# EAGLE schematic arca-2.0 (EAGLE 9.6.2)

## Sheet 1 of 8: Power
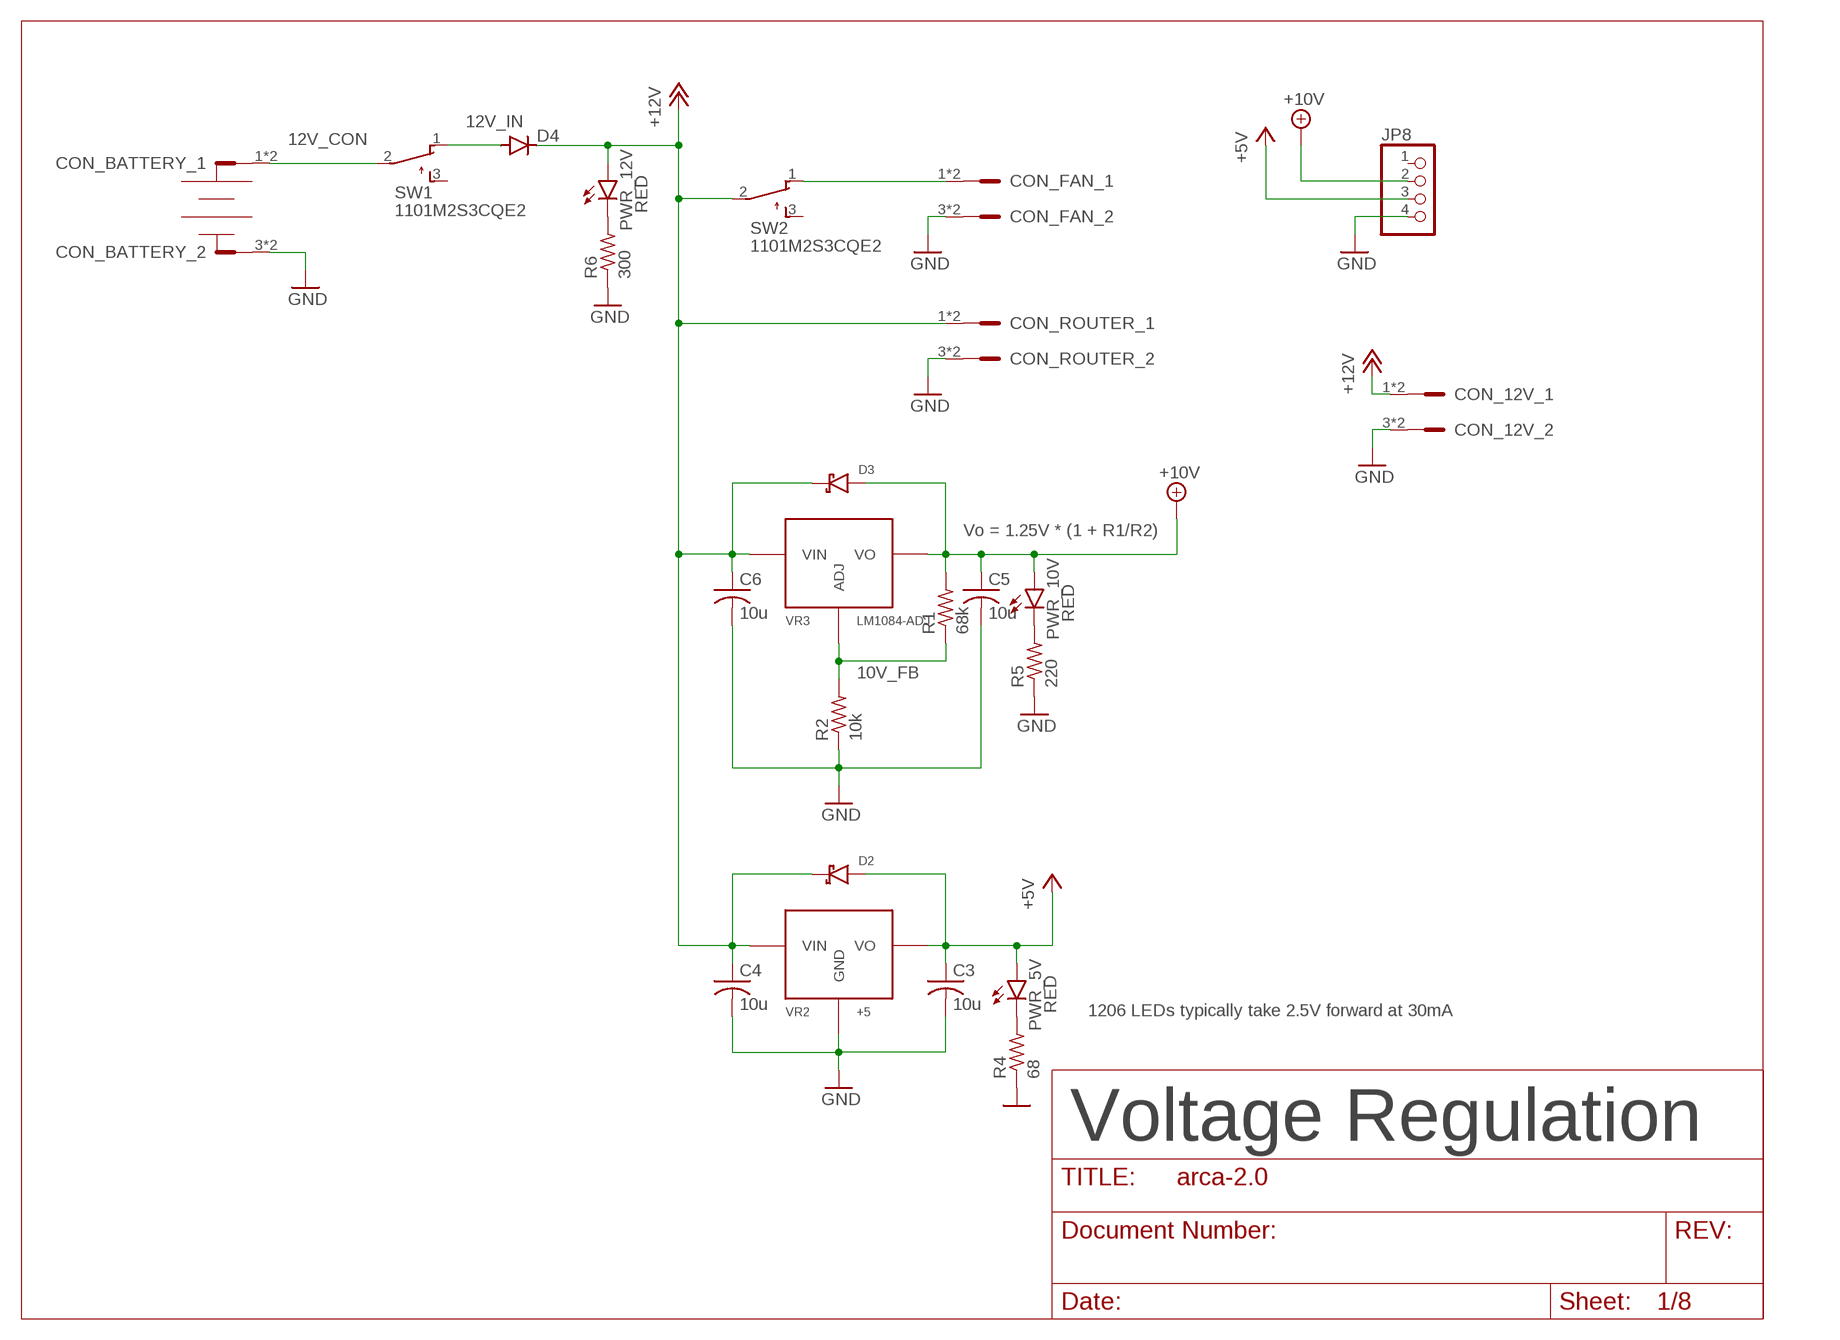
[diagram p0: schematic, sheet 1]

### Parts
C3  10u  C-USC1206  [C1206]
C4  10u  C-USC1206  [C1206]
C5  10u  C-USC1206  [C1206]
C6  10u  C-USC1206  [C1206]
CON_12V  LPTA-2POS  [8.2X2]
CON_BATTERY  LPTA-2POS  [8.2X2]
CON_FAN  LPTA-2POS  [8.2X2]
CON_ROUTER  LPTA-2POS  [8.2X2]
D2  SS54  [SS*]
D3  SS54  [SS*]
D4  DIODE-DO201-15  [DO201-15]
JP8  PINHD-1X4  [1X04]
PWR_5V  RED  LEDCHIPLED_1206  [CHIPLED_1206]
PWR_10V  RED  LEDCHIPLED_1206  [CHIPLED_1206]
PWR_12V  RED  LEDCHIPLED_1206  [CHIPLED_1206]
R1  68k  R-US_R1206  [R1206]
R2  10k  R-US_R1206  [R1206]
R4  68  R-US_R1206  [R1206]
R5  220  R-US_R1206  [R1206]
R6  300  R-US_R1206  [R1206]
SW1  1101M2S3CQE2  [1101M2S3CQE2]
SW2  1101M2S3CQE2  [1101M2S3CQE2]
VR2  +5  LM1084  [TO-263-3L]
VR3  LM1084-ADJ  [TO-263-3L]

### Nets
10V_FB: R1.1 R2.2 VR3.P$1(ADJ)
12V_CON [12V]: CON_BATTERY.1 CON_BATTERY.2 SW1.2(P)
12V_IN [12V]: D4.A SW1.1(O)
+5V [5V]: C3.1 D2.P$2 JP8.3 PWR_5V.A VR2.P$2(VO) VR2.P$4(VO) VR2.P$5(VO) ; also sheet 2,3,6,7,8
+10V [10V]: C5.1 D3.P$2 JP8.2 PWR_10V.A R1.2 VR3.P$2(VO) VR3.P$4(VO) VR3.P$5(VO) ; also sheet 4,5
+12V [12V]: C4.1 C6.1 CON_12V.1 CON_12V.2 CON_ROUTER.1 CON_ROUTER.2 D2.P$1 D3.P$1 D4.C PWR_12V.A SW2.2(P) VR2.P$3(VIN) VR3.P$3(VIN) ; also sheet 2
GND: C3.2 C4.2 C5.2 C6.2 CON_12V.3 CON_12V.4 CON_BATTERY.3 CON_BATTERY.4 CON_FAN.3 CON_FAN.4 CON_ROUTER.3 CON_ROUTER.4 JP8.4 R2.1 R4.1 R5.1 R6.1 VR2.P$1(GND) ; also sheet 2,3,4,5,6,7,8
N$3: PWR_5V.C R4.2
N$4: PWR_10V.C R5.2
N$5: PWR_12V.C R6.2
N$48: CON_FAN.1 CON_FAN.2 SW2.1(O)
Unconnected: JP8.1 SW1.3(S) SW2.3(S)

### Notes on the sheet
- Vo = 1.25V * (1 + R1/R2)
- 1206 LEDs typically take 2.5V forward at 30mA
- Voltage Regulation

## Sheet 2 of 8: Drivers
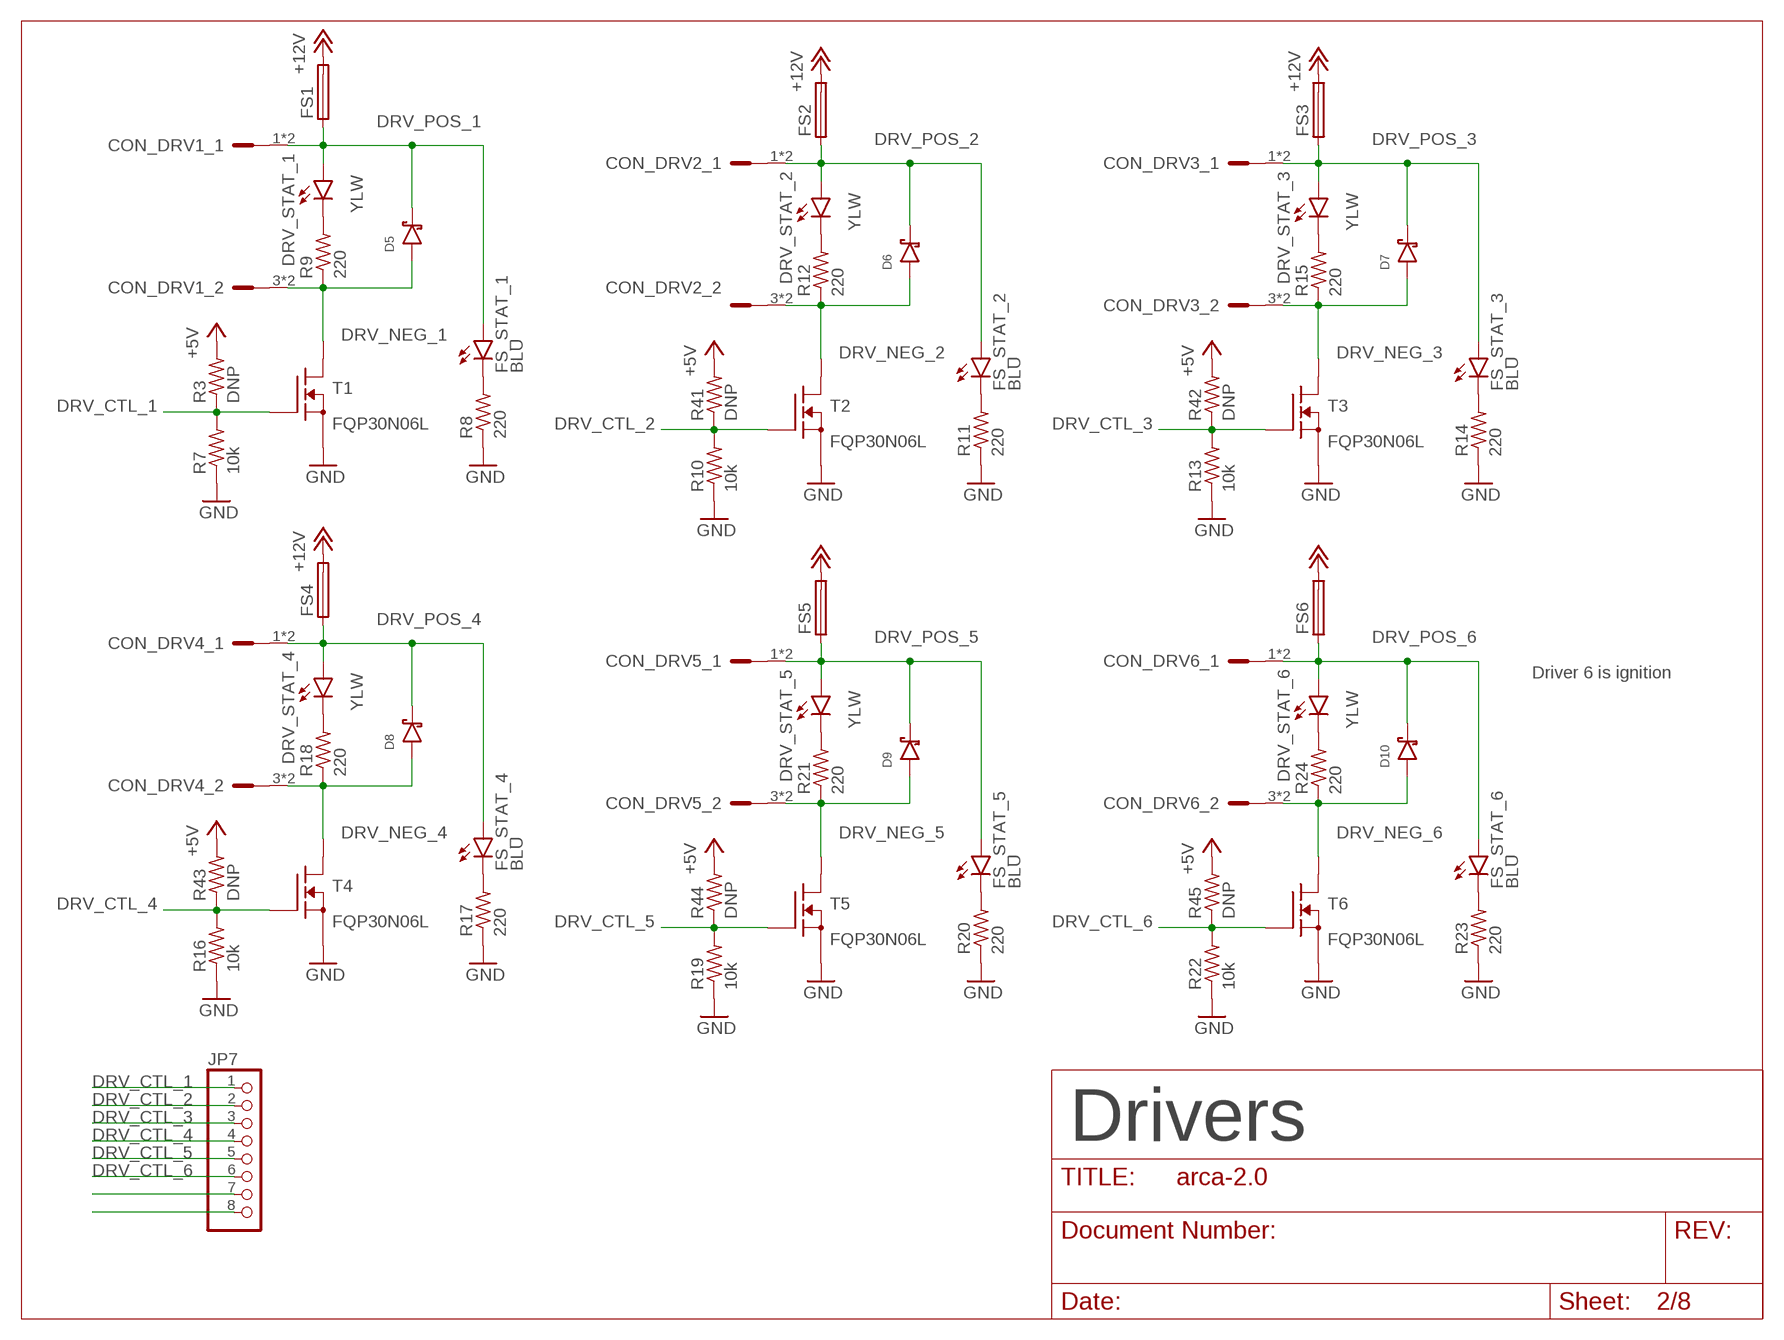
[diagram p1: schematic, sheet 2]

### Parts
CON_DRV1  LPTA-2POS  [8.2X2]
CON_DRV2  LPTA-2POS  [8.2X2]
CON_DRV3  LPTA-2POS  [8.2X2]
CON_DRV4  LPTA-2POS  [8.2X2]
CON_DRV5  LPTA-2POS  [8.2X2]
CON_DRV6  LPTA-2POS  [8.2X2]
D5  SS54  [SS*]
D6  SS54  [SS*]
D7  SS54  [SS*]
D8  SS54  [SS*]
D9  SS54  [SS*]
D10  SS54  [SS*]
DRV_STAT_1  YLW  LEDCHIPLED_1206  [CHIPLED_1206]
DRV_STAT_2  YLW  LEDCHIPLED_1206  [CHIPLED_1206]
DRV_STAT_3  YLW  LEDCHIPLED_1206  [CHIPLED_1206]
DRV_STAT_4  YLW  LEDCHIPLED_1206  [CHIPLED_1206]
DRV_STAT_5  YLW  LEDCHIPLED_1206  [CHIPLED_1206]
DRV_STAT_6  YLW  LEDCHIPLED_1206  [CHIPLED_1206]
FS1  HOLDER_3588-20  [3588-20]
FS2  HOLDER_3588-20  [3588-20]
FS3  HOLDER_3588-20  [3588-20]
FS4  HOLDER_3588-20  [3588-20]
FS5  HOLDER_3588-20  [3588-20]
FS6  HOLDER_3588-20  [3588-20]
FS_STAT_1  BLU  LEDCHIPLED_1206  [CHIPLED_1206]
FS_STAT_2  BLU  LEDCHIPLED_1206  [CHIPLED_1206]
FS_STAT_3  BLU  LEDCHIPLED_1206  [CHIPLED_1206]
FS_STAT_4  BLU  LEDCHIPLED_1206  [CHIPLED_1206]
FS_STAT_5  BLU  LEDCHIPLED_1206  [CHIPLED_1206]
FS_STAT_6  BLU  LEDCHIPLED_1206  [CHIPLED_1206]
JP7  PINHD-1X8  [1X08]
R3  DNP  R-US_R1206  [R1206]
R7  10k  R-US_R1206  [R1206]
R8  220  R-US_R1206  [R1206]
R9  220  R-US_R1206  [R1206]
R10  10k  R-US_R1206  [R1206]
R11  220  R-US_R1206  [R1206]
R12  220  R-US_R1206  [R1206]
R13  10k  R-US_R1206  [R1206]
R14  220  R-US_R1206  [R1206]
R15  220  R-US_R1206  [R1206]
R16  10k  R-US_R1206  [R1206]
R17  220  R-US_R1206  [R1206]
R18  220  R-US_R1206  [R1206]
R19  10k  R-US_R1206  [R1206]
R20  220  R-US_R1206  [R1206]
R21  220  R-US_R1206  [R1206]
R22  10k  R-US_R1206  [R1206]
R23  220  R-US_R1206  [R1206]
R24  220  R-US_R1206  [R1206]
R41  DNP  R-US_R1206  [R1206]
R42  DNP  R-US_R1206  [R1206]
R43  DNP  R-US_R1206  [R1206]
R44  DNP  R-US_R1206  [R1206]
R45  DNP  R-US_R1206  [R1206]
T1  FQP30N06L  [TO220V]
T2  FQP30N06L  [TO220V]
T3  FQP30N06L  [TO220V]
T4  FQP30N06L  [TO220V]
T5  FQP30N06L  [TO220V]
T6  FQP30N06L  [TO220V]

### Nets
+5V [5V]: R3.2 R41.2 R42.2 R43.2 R44.2 R45.2 ; also sheet 1,3,6,7,8
+12V [12V]: FS1.P$3 FS1.P$4 FS2.P$3 FS2.P$4 FS3.P$3 FS3.P$4 FS4.P$3 FS4.P$4 FS5.P$3 FS5.P$4 FS6.P$3 FS6.P$4 ; also sheet 1
DRV_CTL_1: JP7.1 R3.1 R7.2 T1.1(G) ; also sheet 8
DRV_CTL_2: JP7.2 R10.2 R41.1 T2.1(G) ; also sheet 8
DRV_CTL_3: JP7.3 R13.2 R42.1 T3.1(G) ; also sheet 8
DRV_CTL_4: JP7.4 R16.2 R43.1 T4.1(G) ; also sheet 8
DRV_CTL_5: JP7.5 R19.2 R44.1 T5.1(G) ; also sheet 8
DRV_CTL_6: JP7.6 R22.2 R45.1 T6.1(G) ; also sheet 8
DRV_NEG_1 [Driver]: CON_DRV1.3 CON_DRV1.4 D5.P$2 R9.1 T1.2(D)
DRV_NEG_2 [Driver]: CON_DRV2.3 CON_DRV2.4 D6.P$2 R12.1 T2.2(D)
DRV_NEG_3 [Driver]: CON_DRV3.3 CON_DRV3.4 D7.P$2 R15.1 T3.2(D)
DRV_NEG_4 [Driver]: CON_DRV4.3 CON_DRV4.4 D8.P$2 R18.1 T4.2(D)
DRV_NEG_5 [Driver]: CON_DRV5.3 CON_DRV5.4 D9.P$2 R21.1 T5.2(D)
DRV_NEG_6 [Driver]: CON_DRV6.3 CON_DRV6.4 D10.P$2 R24.1 T6.2(D)
DRV_POS_1 [Driver]: CON_DRV1.1 CON_DRV1.2 D5.P$1 DRV_STAT_1.A FS1.P$1 FS1.P$2 FS_STAT_1.A
DRV_POS_2 [Driver]: CON_DRV2.1 CON_DRV2.2 D6.P$1 DRV_STAT_2.A FS2.P$1 FS2.P$2 FS_STAT_2.A
DRV_POS_3 [Driver]: CON_DRV3.1 CON_DRV3.2 D7.P$1 DRV_STAT_3.A FS3.P$1 FS3.P$2 FS_STAT_3.A
DRV_POS_4 [Driver]: CON_DRV4.1 CON_DRV4.2 D8.P$1 DRV_STAT_4.A FS4.P$1 FS4.P$2 FS_STAT_4.A
DRV_POS_5 [Driver]: CON_DRV5.1 CON_DRV5.2 D9.P$1 DRV_STAT_5.A FS5.P$1 FS5.P$2 FS_STAT_5.A
DRV_POS_6 [Driver]: CON_DRV6.1 CON_DRV6.2 D10.P$1 DRV_STAT_6.A FS6.P$1 FS6.P$2 FS_STAT_6.A
GND: R7.1 R8.1 R10.1 R11.1 R13.1 R14.1 R16.1 R17.1 R19.1 R20.1 R22.1 R23.1 T1.3(S) T2.3(S) T3.3(S) T4.3(S) T5.3(S) T6.3(S) ; also sheet 1,3,4,5,6,7,8
N$1: FS_STAT_2.C R11.2
N$6: DRV_STAT_2.C R12.2
N$7: FS_STAT_3.C R14.2
N$8: FS_STAT_1.C R8.2
N$9: DRV_STAT_1.C R9.2
N$10: DRV_STAT_3.C R15.2
N$11: FS_STAT_4.C R17.2
N$12: DRV_STAT_4.C R18.2
N$13: FS_STAT_5.C R20.2
N$14: DRV_STAT_5.C R21.2
N$15: FS_STAT_6.C R23.2
N$16: DRV_STAT_6.C R24.2
N$67: JP7.7
N$68: JP7.8

### Notes on the sheet
- Driver 6 is ignition
- Drivers

## Sheet 3 of 8: Load Cell Inamps
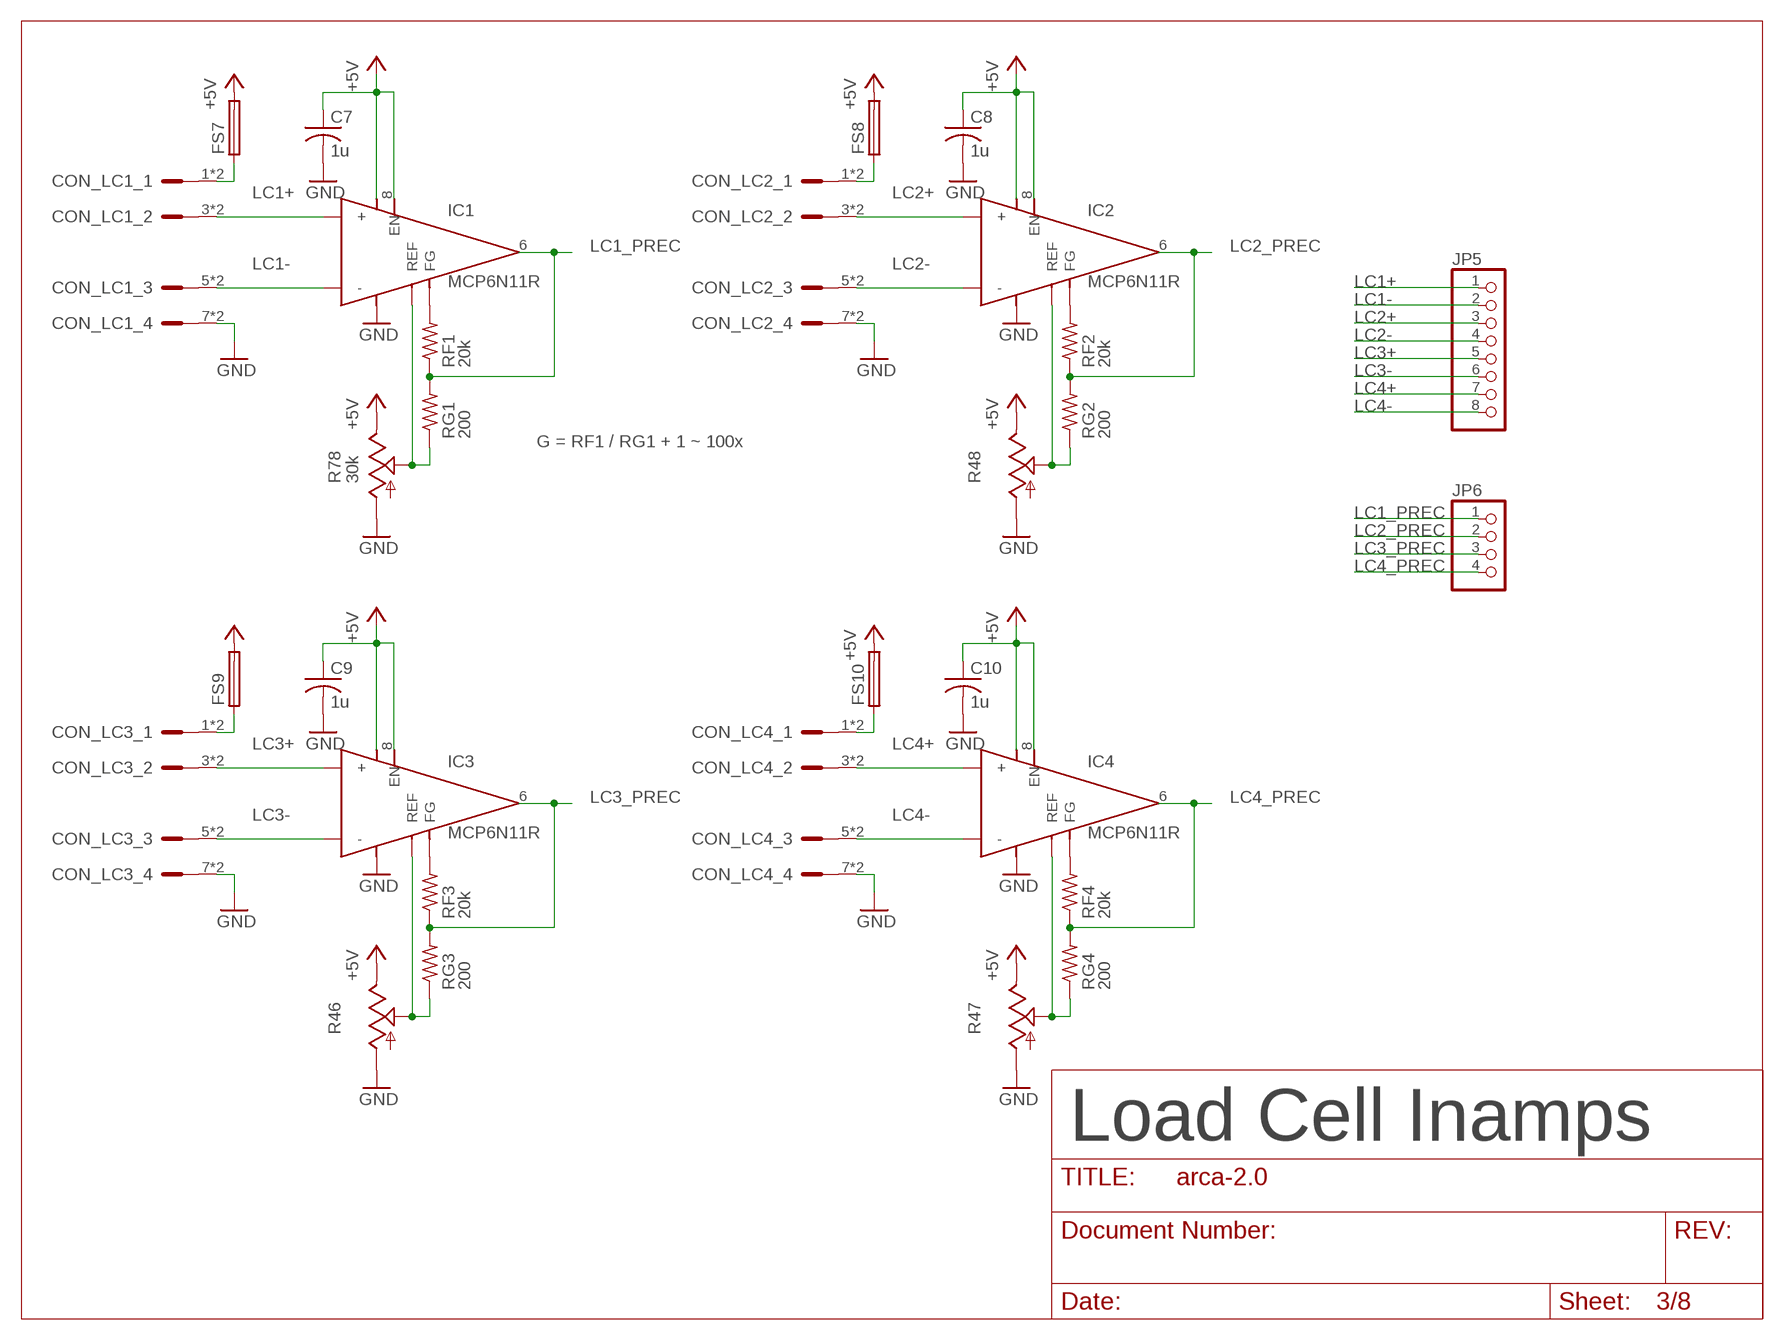
[diagram p2: schematic, sheet 3]

### Parts
C7  1u  C-USC1206  [C1206]
C8  1u  C-USC1206  [C1206]
C9  1u  C-USC1206  [C1206]
C10  1u  C-USC1206  [C1206]
CON_LC1  LPTA-4POS  [8.2X4]
CON_LC2  LPTA-4POS  [8.2X4]
CON_LC3  LPTA-4POS  [8.2X4]
CON_LC4  LPTA-4POS  [8.2X4]
FS7  HOLDER_3588-20  [3588-20]
FS8  HOLDER_3588-20  [3588-20]
FS9  HOLDER_3588-20  [3588-20]
FS10  HOLDER_3588-20  [3588-20]
IC1  MCP6N11R  [SO-8]
IC2  MCP6N11R  [SO-8]
IC3  MCP6N11R  [SO-8]
IC4  MCP6N11R  [SO-8]
JP5  PINHD-1X8  [1X08]
JP6  PINHD-1X4  [1X04]
R46  TRIM_US-S64W  [S64W]
R47  TRIM_US-S64W  [S64W]
R48  TRIM_US-S64W  [S64W]
R78  30k  TRIM_US-S64W  [S64W]
RF1  20k  R-US_R1206  [R1206]
RF2  20k  R-US_R1206  [R1206]
RF3  20k  R-US_R1206  [R1206]
RF4  20k  R-US_R1206  [R1206]
RG1  200  R-US_R1206  [R1206]
RG2  200  R-US_R1206  [R1206]
RG3  200  R-US_R1206  [R1206]
RG4  200  R-US_R1206  [R1206]

### Nets
+5V [5V]: C7.1 C8.1 C9.1 C10.1 FS7.P$3 FS7.P$4 FS8.P$3 FS8.P$4 FS9.P$3 FS9.P$4 FS10.P$3 FS10.P$4 IC1.7(+V) IC1.8(EN) IC2.7(+V) IC2.8(EN) IC3.7(+V) IC3.8(EN) IC4.7(+V) IC4.8(EN) R46.E R47.E R48.E R78.E ; also sheet 1,2,6,7,8
GND: C7.2 C8.2 C9.2 C10.2 CON_LC1.7 CON_LC1.8 CON_LC2.7 CON_LC2.8 CON_LC3.7 CON_LC3.8 CON_LC4.7 CON_LC4.8 IC1.4(-V) IC2.4(-V) IC3.4(-V) IC4.4(-V) R46.A R47.A R48.A R78.A ; also sheet 1,2,4,5,6,7,8
LC1+: CON_LC1.3 CON_LC1.4 IC1.3(+) JP5.1
LC1-: CON_LC1.5 CON_LC1.6 IC1.2(-) JP5.2
LC1_PREC: IC1.6(OUT) JP6.1 RF1.1 RG1.2 ; also sheet 4
LC2+: CON_LC2.3 CON_LC2.4 IC2.3(+) JP5.3
LC2-: CON_LC2.5 CON_LC2.6 IC2.2(-) JP5.4
LC2_PREC: IC2.6(OUT) JP6.2 RF2.1 RG2.2 ; also sheet 4
LC3+: CON_LC3.3 CON_LC3.4 IC3.3(+) JP5.5
LC3-: CON_LC3.5 CON_LC3.6 IC3.2(-) JP5.6
LC3_PREC: IC3.6(OUT) JP6.3 RF3.1 RG3.2 ; also sheet 4
LC4+: CON_LC4.3 CON_LC4.4 IC4.3(+) JP5.7
LC4-: CON_LC4.5 CON_LC4.6 IC4.2(-) JP5.8
LC4_PREC: IC4.6(OUT) JP6.4 RF4.1 RG4.2 ; also sheet 4
N$2: IC1.5(REF) R78.S RG1.1
N$17: IC2.5(REF) R48.S RG2.1
N$18: IC1.1(FG) RF1.2
N$21: IC2.1(FG) RF2.2
N$24: IC3.1(FG) RF3.2
N$27: IC4.1(FG) RF4.2
N$28: IC4.5(REF) R47.S RG4.1
N$37: IC3.5(REF) R46.S RG3.1
N$61: CON_LC1.1 CON_LC1.2 FS7.P$1 FS7.P$2
N$62: CON_LC2.1 CON_LC2.2 FS8.P$1 FS8.P$2
N$63: CON_LC3.1 CON_LC3.2 FS9.P$1 FS9.P$2
N$64: CON_LC4.1 CON_LC4.2 FS10.P$1 FS10.P$2

### Notes on the sheet
- G = RF1 / RG1 + 1 ~ 100x
- Load Cell Inamps

## Sheet 4 of 8: Anti-Aliasing
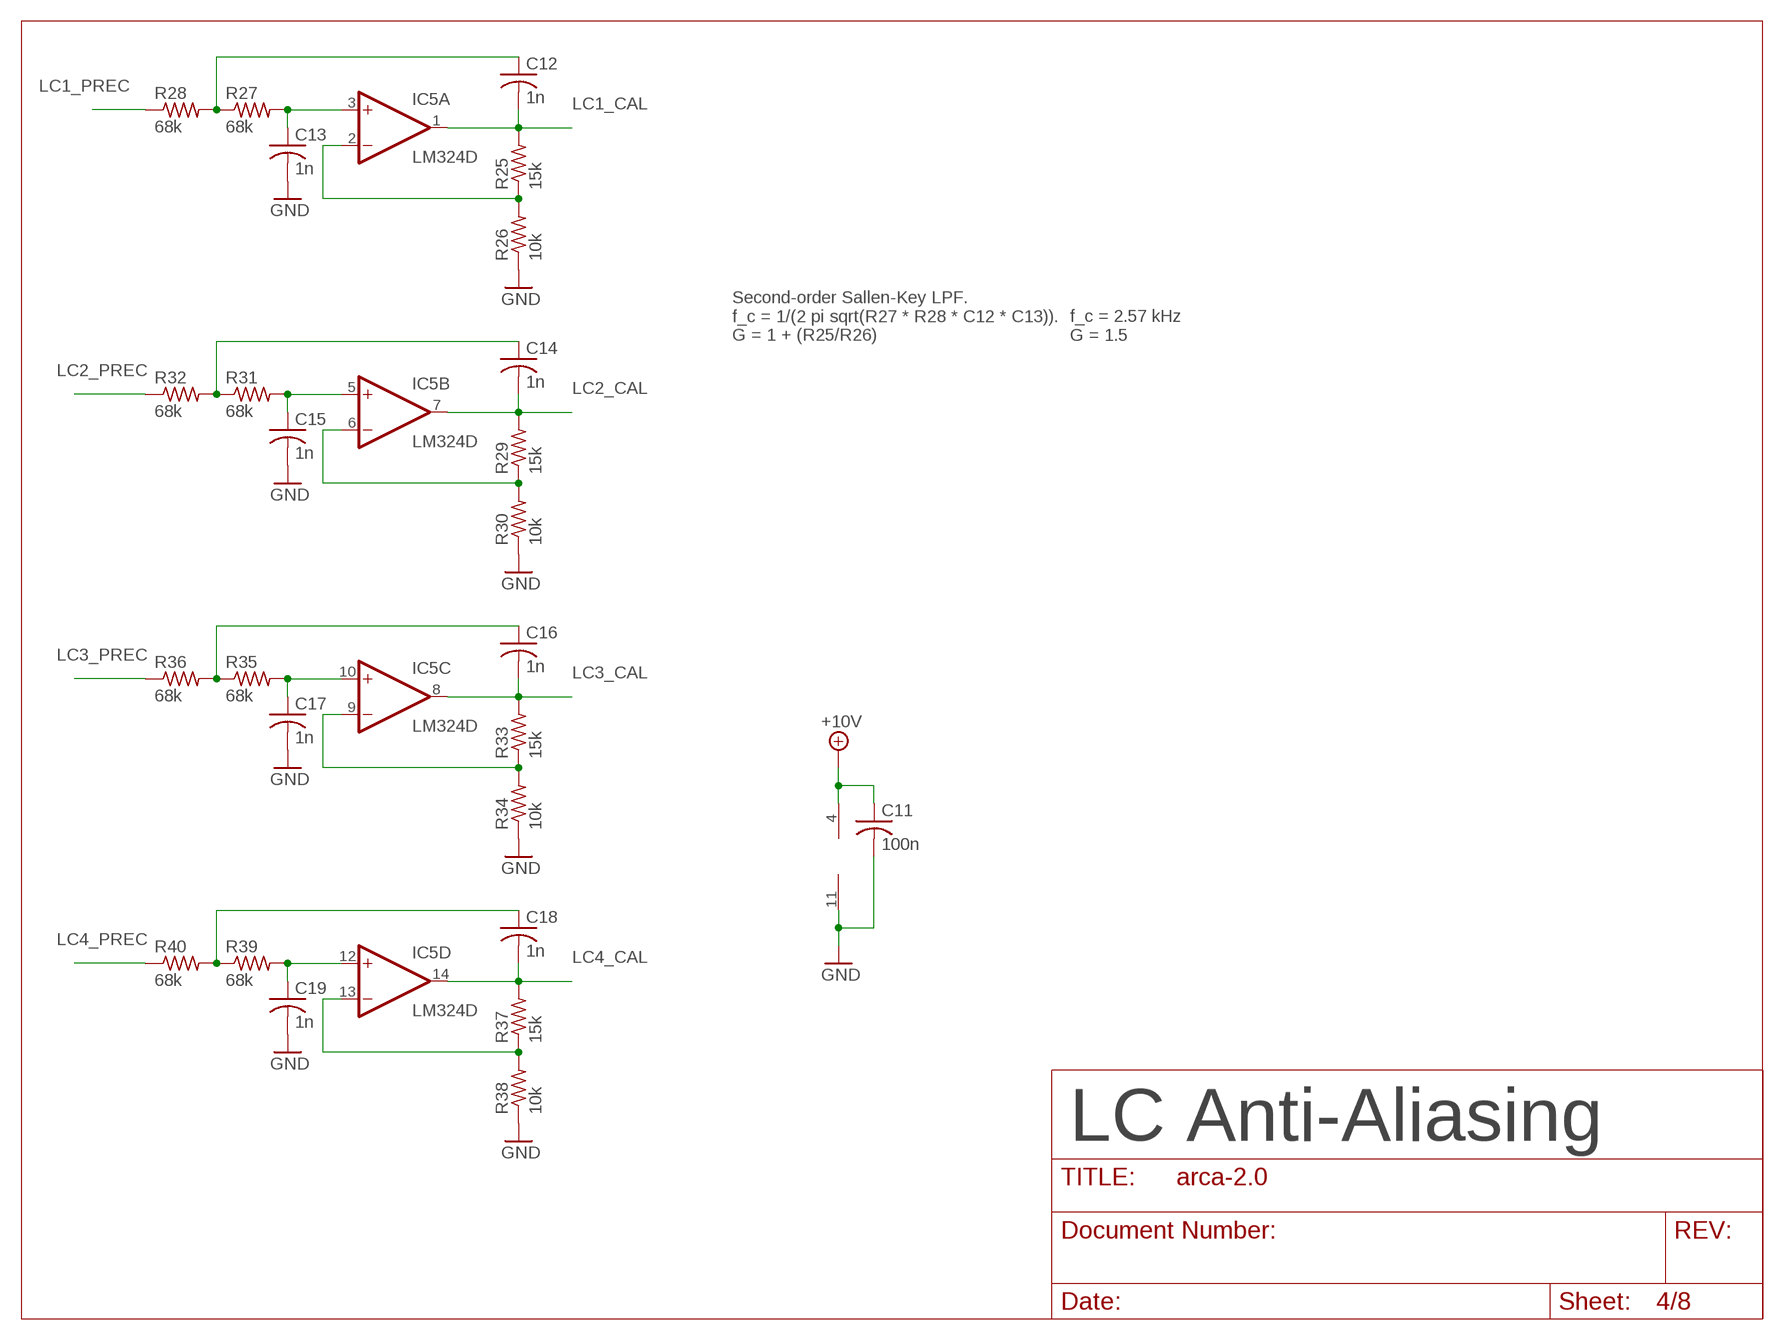
[diagram p3: schematic, sheet 4]

### Parts
C11  100n  C-USC1206  [C1206]
C12  1n  C-USC1206  [C1206]
C13  1n  C-USC1206  [C1206]
C14  1n  C-USC1206  [C1206]
C15  1n  C-USC1206  [C1206]
C16  1n  C-USC1206  [C1206]
C17  1n  C-USC1206  [C1206]
C18  1n  C-USC1206  [C1206]
C19  1n  C-USC1206  [C1206]
IC5  LM324D  [SO14]
R25  15k  R-US_R1206  [R1206]
R26  10k  R-US_R1206  [R1206]
R27  68k  R-US_R1206  [R1206]
R28  68k  R-US_R1206  [R1206]
R29  15k  R-US_R1206  [R1206]
R30  10k  R-US_R1206  [R1206]
R31  68k  R-US_R1206  [R1206]
R32  68k  R-US_R1206  [R1206]
R33  15k  R-US_R1206  [R1206]
R34  10k  R-US_R1206  [R1206]
R35  68k  R-US_R1206  [R1206]
R36  68k  R-US_R1206  [R1206]
R37  15k  R-US_R1206  [R1206]
R38  10k  R-US_R1206  [R1206]
R39  68k  R-US_R1206  [R1206]
R40  68k  R-US_R1206  [R1206]

### Nets
+10V [10V]: C11.1 IC5.4(P:V+) ; also sheet 1,5
GND: C11.2 C13.2 C15.2 C17.2 C19.2 IC5.11(P:V-) R26.1 R30.1 R34.1 R38.1 ; also sheet 1,2,3,5,6,7,8
LC1_CAL: C12.2 IC5.1(A:OUT) R25.2 ; also sheet 7
LC1_PREC: R28.1 ; also sheet 3
LC2_CAL: C14.2 IC5.7(B:OUT) R29.2 ; also sheet 7
LC2_PREC: R32.1 ; also sheet 3
LC3_CAL: C16.2 IC5.8(C:OUT) R33.2 ; also sheet 7
LC3_PREC: R36.1 ; also sheet 3
LC4_CAL: C18.2 IC5.14(D:OUT) R37.2 ; also sheet 7
LC4_PREC: R40.1 ; also sheet 3
N$19: IC5.9(C:-IN) R33.1 R34.2
N$20: C17.1 IC5.10(C:+IN) R35.2
N$23: C16.1 R35.1 R36.2
N$26: IC5.13(D:-IN) R37.1 R38.2
N$29: IC5.2(A:-IN) R25.1 R26.2
N$30: IC5.6(B:-IN) R29.1 R30.2
N$31: C13.1 IC5.3(A:+IN) R27.2
N$32: C12.1 R27.1 R28.2
N$33: C15.1 IC5.5(B:+IN) R31.2
N$34: C14.1 R31.1 R32.2
N$35: C19.1 IC5.12(D:+IN) R39.2
N$36: C18.1 R39.1 R40.2

### Notes on the sheet
- Second-order Sallen-Key LPF. 
  f_c = 1/(2 pi sqrt(R27 * R28 * C12 * C13)).
  G = 1 + (R25/R26)
- f_c = 2.57 kHz
  G = 1.5
- LC Anti-Aliasing

## Sheet 5 of 8: Pressure Transducers
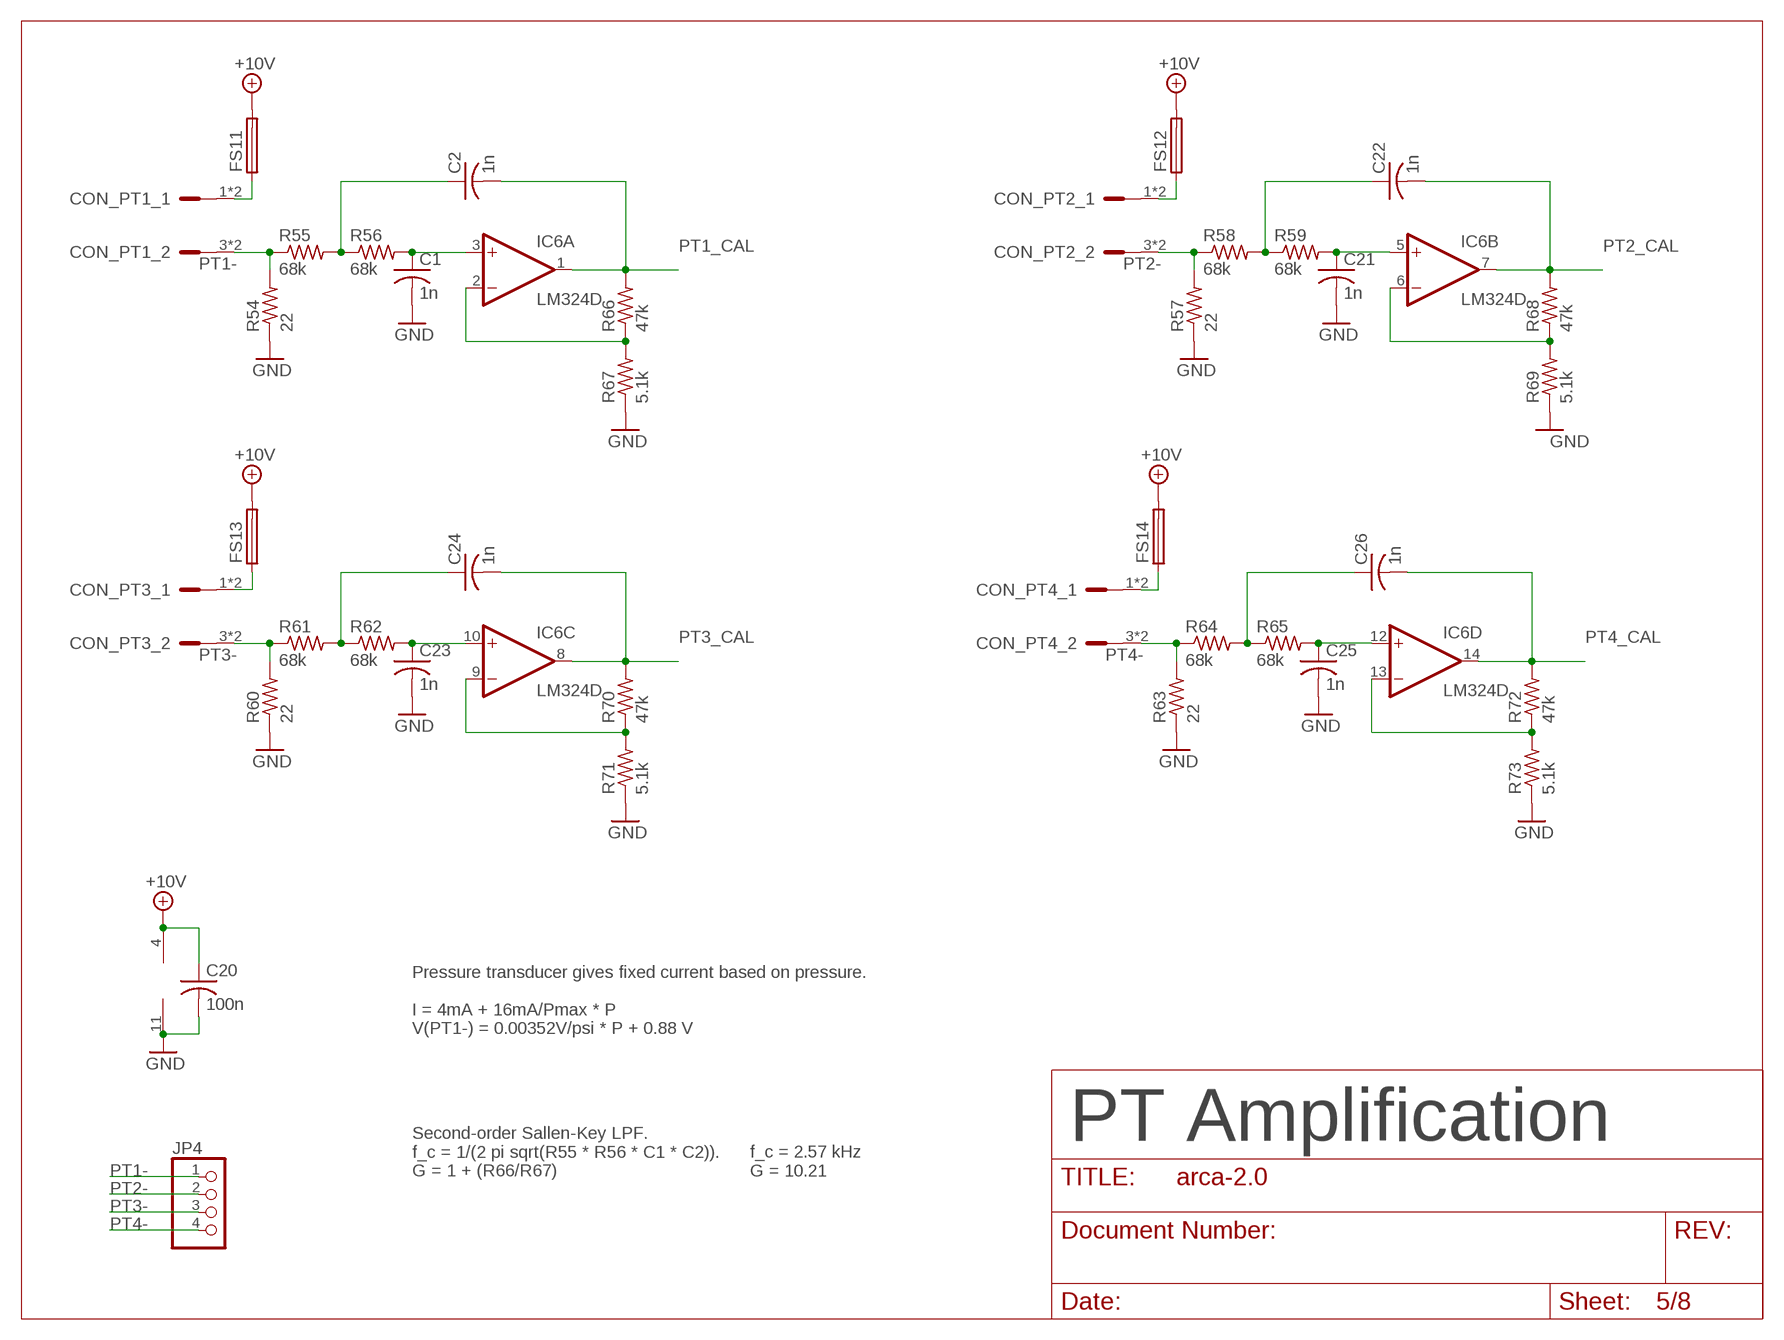
[diagram p4: schematic, sheet 5]

### Parts
C1  1n  C-USC1206  [C1206]
C2  1n  C-USC1206  [C1206]
C20  100n  C-USC1206  [C1206]
C21  1n  C-USC1206  [C1206]
C22  1n  C-USC1206  [C1206]
C23  1n  C-USC1206  [C1206]
C24  1n  C-USC1206  [C1206]
C25  1n  C-USC1206  [C1206]
C26  1n  C-USC1206  [C1206]
CON_PT1  LPTA-2POS  [8.2X2]
CON_PT2  LPTA-2POS  [8.2X2]
CON_PT3  LPTA-2POS  [8.2X2]
CON_PT4  LPTA-2POS  [8.2X2]
FS11  HOLDER_3588-20  [3588-20]
FS12  HOLDER_3588-20  [3588-20]
FS13  HOLDER_3588-20  [3588-20]
FS14  HOLDER_3588-20  [3588-20]
IC6  LM324D  [SO14]
JP4  PINHD-1X4  [1X04]
R54  22  R-US_R1206  [R1206]
R55  68k  R-US_R1206  [R1206]
R56  68k  R-US_R1206  [R1206]
R57  22  R-US_R1206  [R1206]
R58  68k  R-US_R1206  [R1206]
R59  68k  R-US_R1206  [R1206]
R60  22  R-US_R1206  [R1206]
R61  68k  R-US_R1206  [R1206]
R62  68k  R-US_R1206  [R1206]
R63  22  R-US_R1206  [R1206]
R64  68k  R-US_R1206  [R1206]
R65  68k  R-US_R1206  [R1206]
R66  47k  R-US_R1206  [R1206]
R67  5.1k  R-US_R1206  [R1206]
R68  47k  R-US_R1206  [R1206]
R69  5.1k  R-US_R1206  [R1206]
R70  47k  R-US_R1206  [R1206]
R71  5.1k  R-US_R1206  [R1206]
R72  47k  R-US_R1206  [R1206]
R73  5.1k  R-US_R1206  [R1206]

### Nets
+10V [10V]: C20.1 FS11.P$3 FS11.P$4 FS12.P$3 FS12.P$4 FS13.P$3 FS13.P$4 FS14.P$3 FS14.P$4 IC6.4(P:V+) ; also sheet 1,4
GND: C1.2 C20.2 C21.2 C23.2 C25.2 IC6.11(P:V-) R54.1 R57.1 R60.1 R63.1 R67.1 R69.1 R71.1 R73.1 ; also sheet 1,2,3,4,6,7,8
N$22: C22.1 R58.2 R59.1
N$25: C2.1 R55.2 R56.1
N$38: C1.1 IC6.3(A:+IN) R56.2
N$39: C21.1 IC6.5(B:+IN) R59.2
N$40: C24.1 R61.2 R62.1
N$41: C23.1 IC6.10(C:+IN) R62.2
N$42: C26.1 R64.2 R65.1
N$43: C25.1 IC6.12(D:+IN) R65.2
N$44: IC6.13(D:-IN) R72.1 R73.2
N$45: IC6.9(C:-IN) R70.1 R71.2
N$46: IC6.6(B:-IN) R68.1 R69.2
N$47: IC6.2(A:-IN) R66.1 R67.2
N$65: CON_PT1.1 CON_PT1.2 FS11.P$1 FS11.P$2
N$66: CON_PT2.1 CON_PT2.2 FS12.P$1 FS12.P$2
N$69: CON_PT3.1 CON_PT3.2 FS13.P$1 FS13.P$2
N$70: CON_PT4.1 CON_PT4.2 FS14.P$1 FS14.P$2
PT1-: CON_PT1.3 CON_PT1.4 JP4.1 R54.2 R55.1
PT1_CAL: C2.2 IC6.1(A:OUT) R66.2 ; also sheet 7
PT2-: CON_PT2.3 CON_PT2.4 JP4.2 R57.2 R58.1
PT2_CAL: C22.2 IC6.7(B:OUT) R68.2 ; also sheet 7
PT3-: CON_PT3.3 CON_PT3.4 JP4.3 R60.2 R61.1
PT3_CAL: C24.2 IC6.8(C:OUT) R70.2 ; also sheet 7
PT4-: CON_PT4.3 CON_PT4.4 JP4.4 R63.2 R64.1
PT4_CAL: C26.2 IC6.14(D:OUT) R72.2 ; also sheet 7

### Notes on the sheet
- Pressure transducer gives fixed current based on pressure.
  
  I = 4mA + 16mA/Pmax * P
  V(PT1-) = 0.00352V/psi * P + 0.88 V
- PT Amplification
- Second-order Sallen-Key LPF. 
  f_c = 1/(2 pi sqrt(R55 * R56 * C1 * C2)).
  G = 1 + (R66/R67)
- f_c = 2.57 kHz
  G = 10.21

## Sheet 6 of 8: Thermocouples
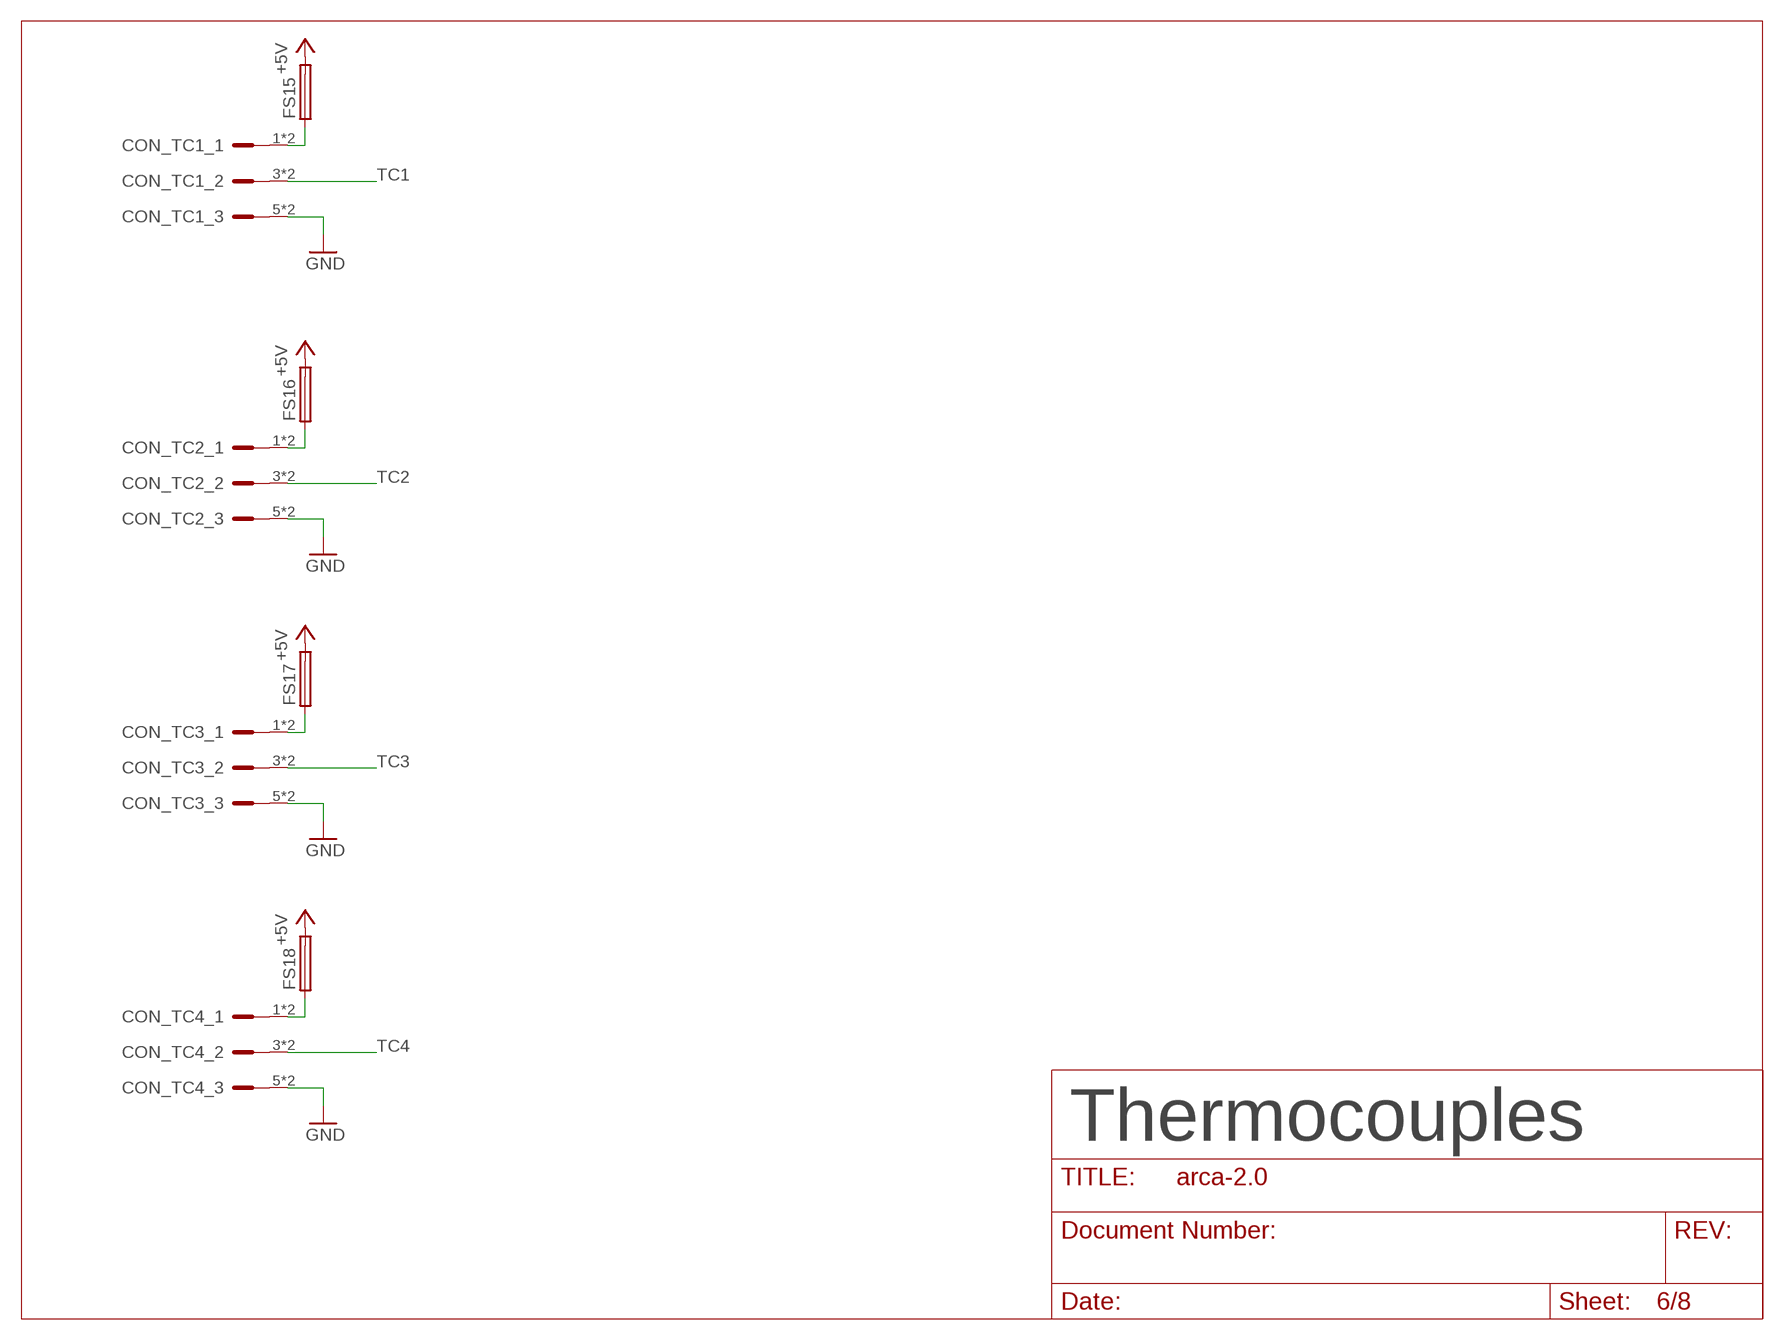
[diagram p5: schematic, sheet 6]

### Parts
CON_TC1  LPTA-3POS  [8.2X3]
CON_TC2  LPTA-3POS  [8.2X3]
CON_TC3  LPTA-3POS  [8.2X3]
CON_TC4  LPTA-3POS  [8.2X3]
FS15  HOLDER_3588-20  [3588-20]
FS16  HOLDER_3588-20  [3588-20]
FS17  HOLDER_3588-20  [3588-20]
FS18  HOLDER_3588-20  [3588-20]

### Nets
+5V [5V]: FS15.P$3 FS15.P$4 FS16.P$3 FS16.P$4 FS17.P$3 FS17.P$4 FS18.P$3 FS18.P$4 ; also sheet 1,2,3,7,8
GND: CON_TC1.5 CON_TC1.6 CON_TC2.5 CON_TC2.6 CON_TC3.5 CON_TC3.6 CON_TC4.5 CON_TC4.6 ; also sheet 1,2,3,4,5,7,8
N$71: CON_TC1.1 CON_TC1.2 FS15.P$1 FS15.P$2
N$72: CON_TC2.1 CON_TC2.2 FS16.P$1 FS16.P$2
N$73: CON_TC3.1 CON_TC3.2 FS17.P$1 FS17.P$2
N$74: CON_TC4.1 CON_TC4.2 FS18.P$1 FS18.P$2
TC1: CON_TC1.3 CON_TC1.4 ; also sheet 7
TC2: CON_TC2.3 CON_TC2.4 ; also sheet 7
TC3: CON_TC3.3 CON_TC3.4 ; also sheet 7
TC4: CON_TC4.3 CON_TC4.4 ; also sheet 7

### Notes on the sheet
- Thermocouples

## Sheet 7 of 8: ADC
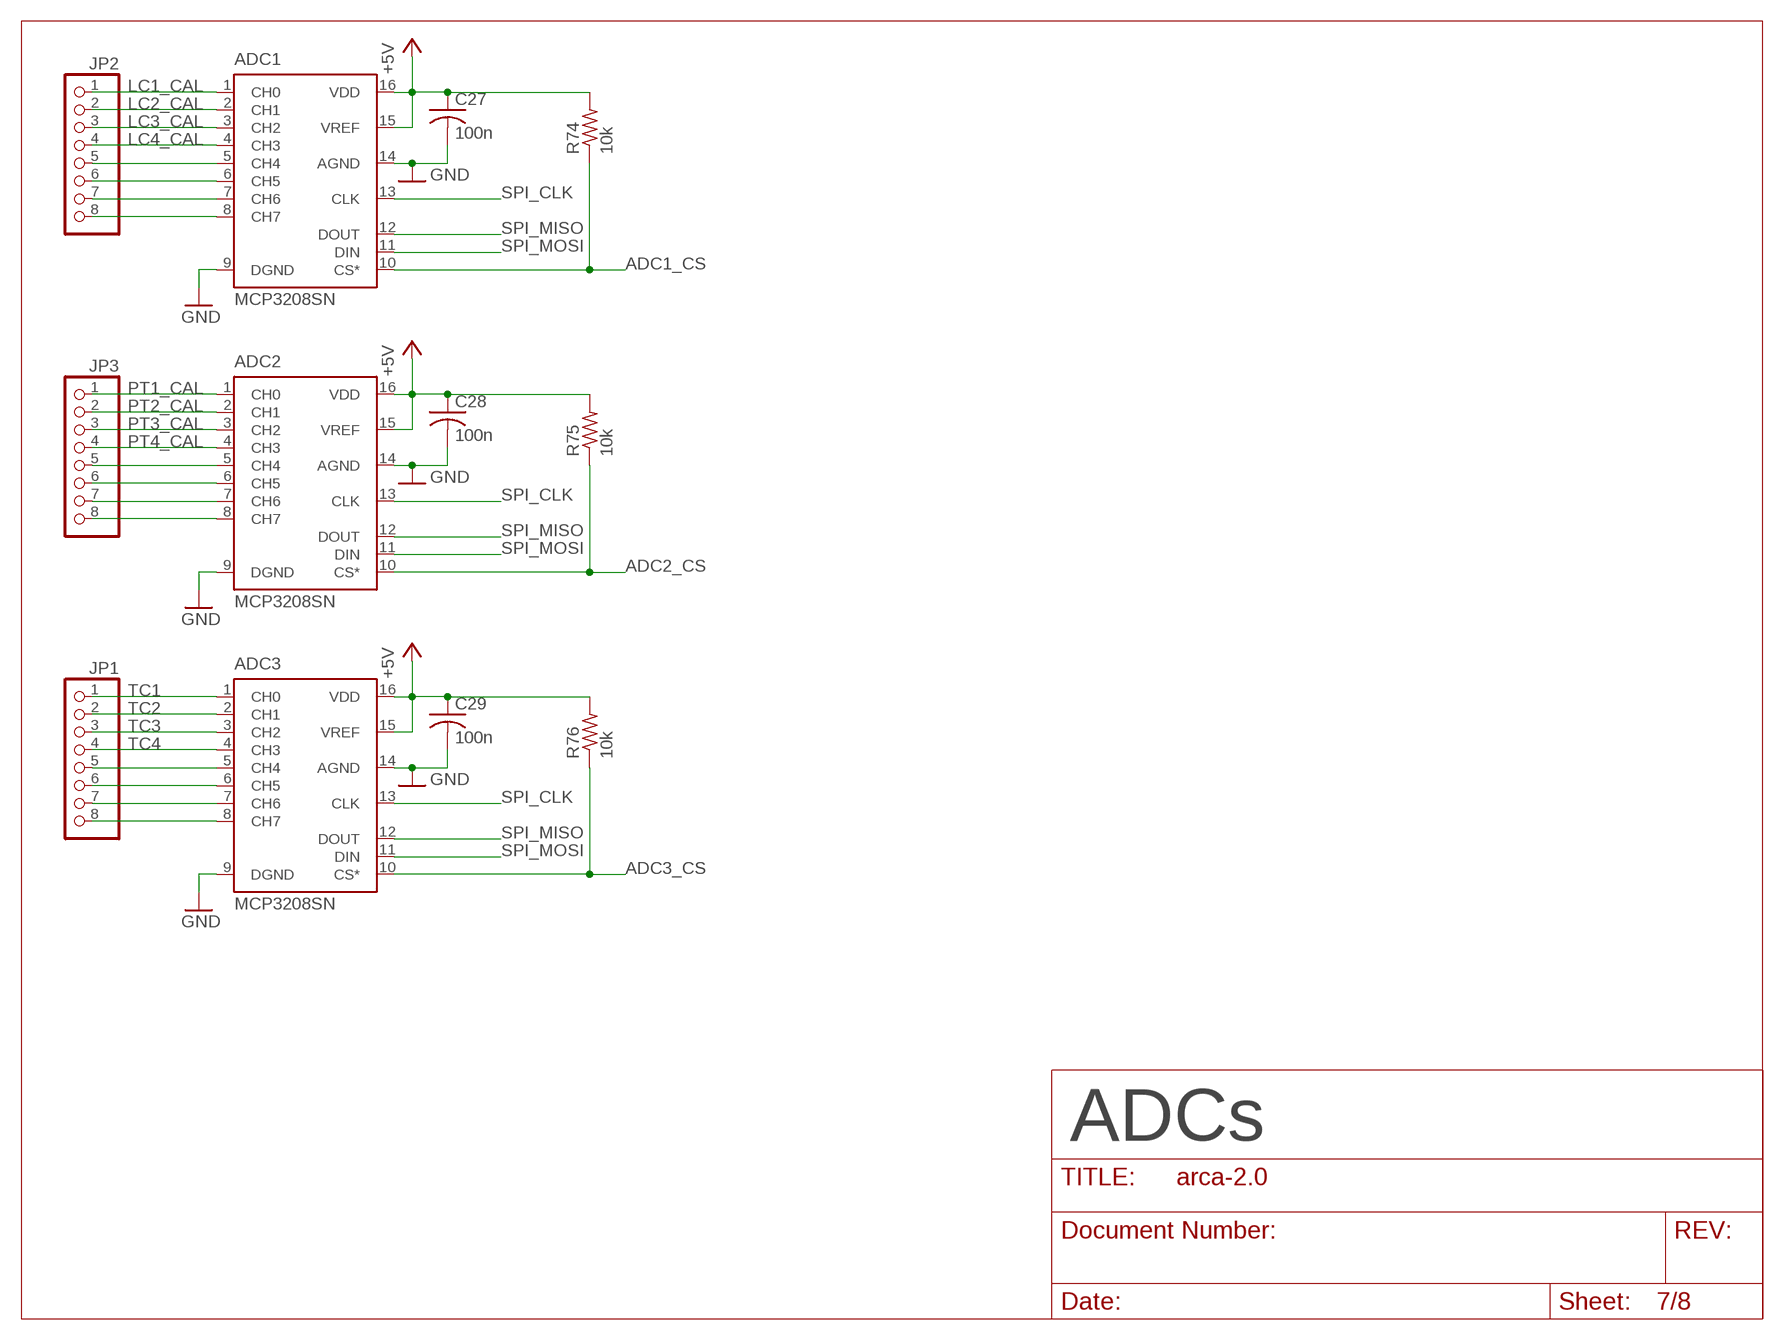
[diagram p6: schematic, sheet 7]

### Parts
ADC1  MCP3208SN  [SO-16]
ADC2  MCP3208SN  [SO-16]
ADC3  MCP3208SN  [SO-16]
C27  100n  C-USC1206  [C1206]
C28  100n  C-USC1206  [C1206]
C29  100n  C-USC1206  [C1206]
JP1  PINHD-1X8  [1X08]
JP2  PINHD-1X8  [1X08]
JP3  PINHD-1X8  [1X08]
R74  10k  R-US_R1206  [R1206]
R75  10k  R-US_R1206  [R1206]
R76  10k  R-US_R1206  [R1206]

### Nets
+5V [5V]: ADC1.15(VREF) ADC1.16(VDD) ADC2.15(VREF) ADC2.16(VDD) ADC3.15(VREF) ADC3.16(VDD) C27.1 C28.1 C29.1 R74.2 R75.2 R76.2 ; also sheet 1,2,3,6,8
ADC1_CS: ADC1.10(CS*) R74.1 ; also sheet 8
ADC2_CS: ADC2.10(CS*) R75.1 ; also sheet 8
ADC3_CS: ADC3.10(CS*) R76.1 ; also sheet 8
GND: ADC1.9(DGND) ADC1.14(AGND) ADC2.9(DGND) ADC2.14(AGND) ADC3.9(DGND) ADC3.14(AGND) C27.2 C28.2 C29.2 ; also sheet 1,2,3,4,5,6,8
LC1_CAL: ADC1.1(CH0) JP2.1 ; also sheet 4
LC2_CAL: ADC1.2(CH1) JP2.2 ; also sheet 4
LC3_CAL: ADC1.3(CH2) JP2.3 ; also sheet 4
LC4_CAL: ADC1.4(CH3) JP2.4 ; also sheet 4
N$49: ADC3.5(CH4) JP1.5
N$50: ADC3.6(CH5) JP1.6
N$51: ADC3.7(CH6) JP1.7
N$52: ADC3.8(CH7) JP1.8
N$53: ADC1.8(CH7) JP2.8
N$54: ADC1.7(CH6) JP2.7
N$55: ADC1.6(CH5) JP2.6
N$56: ADC1.5(CH4) JP2.5
N$57: ADC2.5(CH4) JP3.5
N$58: ADC2.6(CH5) JP3.6
N$59: ADC2.7(CH6) JP3.7
N$60: ADC2.8(CH7) JP3.8
PT1_CAL: ADC2.1(CH0) JP3.1 ; also sheet 5
PT2_CAL: ADC2.2(CH1) JP3.2 ; also sheet 5
PT3_CAL: ADC2.3(CH2) JP3.3 ; also sheet 5
PT4_CAL: ADC2.4(CH3) JP3.4 ; also sheet 5
SPI_CLK: ADC1.13(CLK) ADC2.13(CLK) ADC3.13(CLK) ; also sheet 8
SPI_MISO: ADC1.12(DOUT) ADC2.12(DOUT) ADC3.12(DOUT) ; also sheet 8
SPI_MOSI: ADC1.11(DIN) ADC2.11(DIN) ADC3.11(DIN) ; also sheet 8
TC1: ADC3.1(CH0) JP1.1 ; also sheet 6
TC2: ADC3.2(CH1) JP1.2 ; also sheet 6
TC3: ADC3.3(CH2) JP1.3 ; also sheet 6
TC4: ADC3.4(CH3) JP1.4 ; also sheet 6

### Notes on the sheet
- ADCs

## Sheet 8 of 8: Raspberry Pi
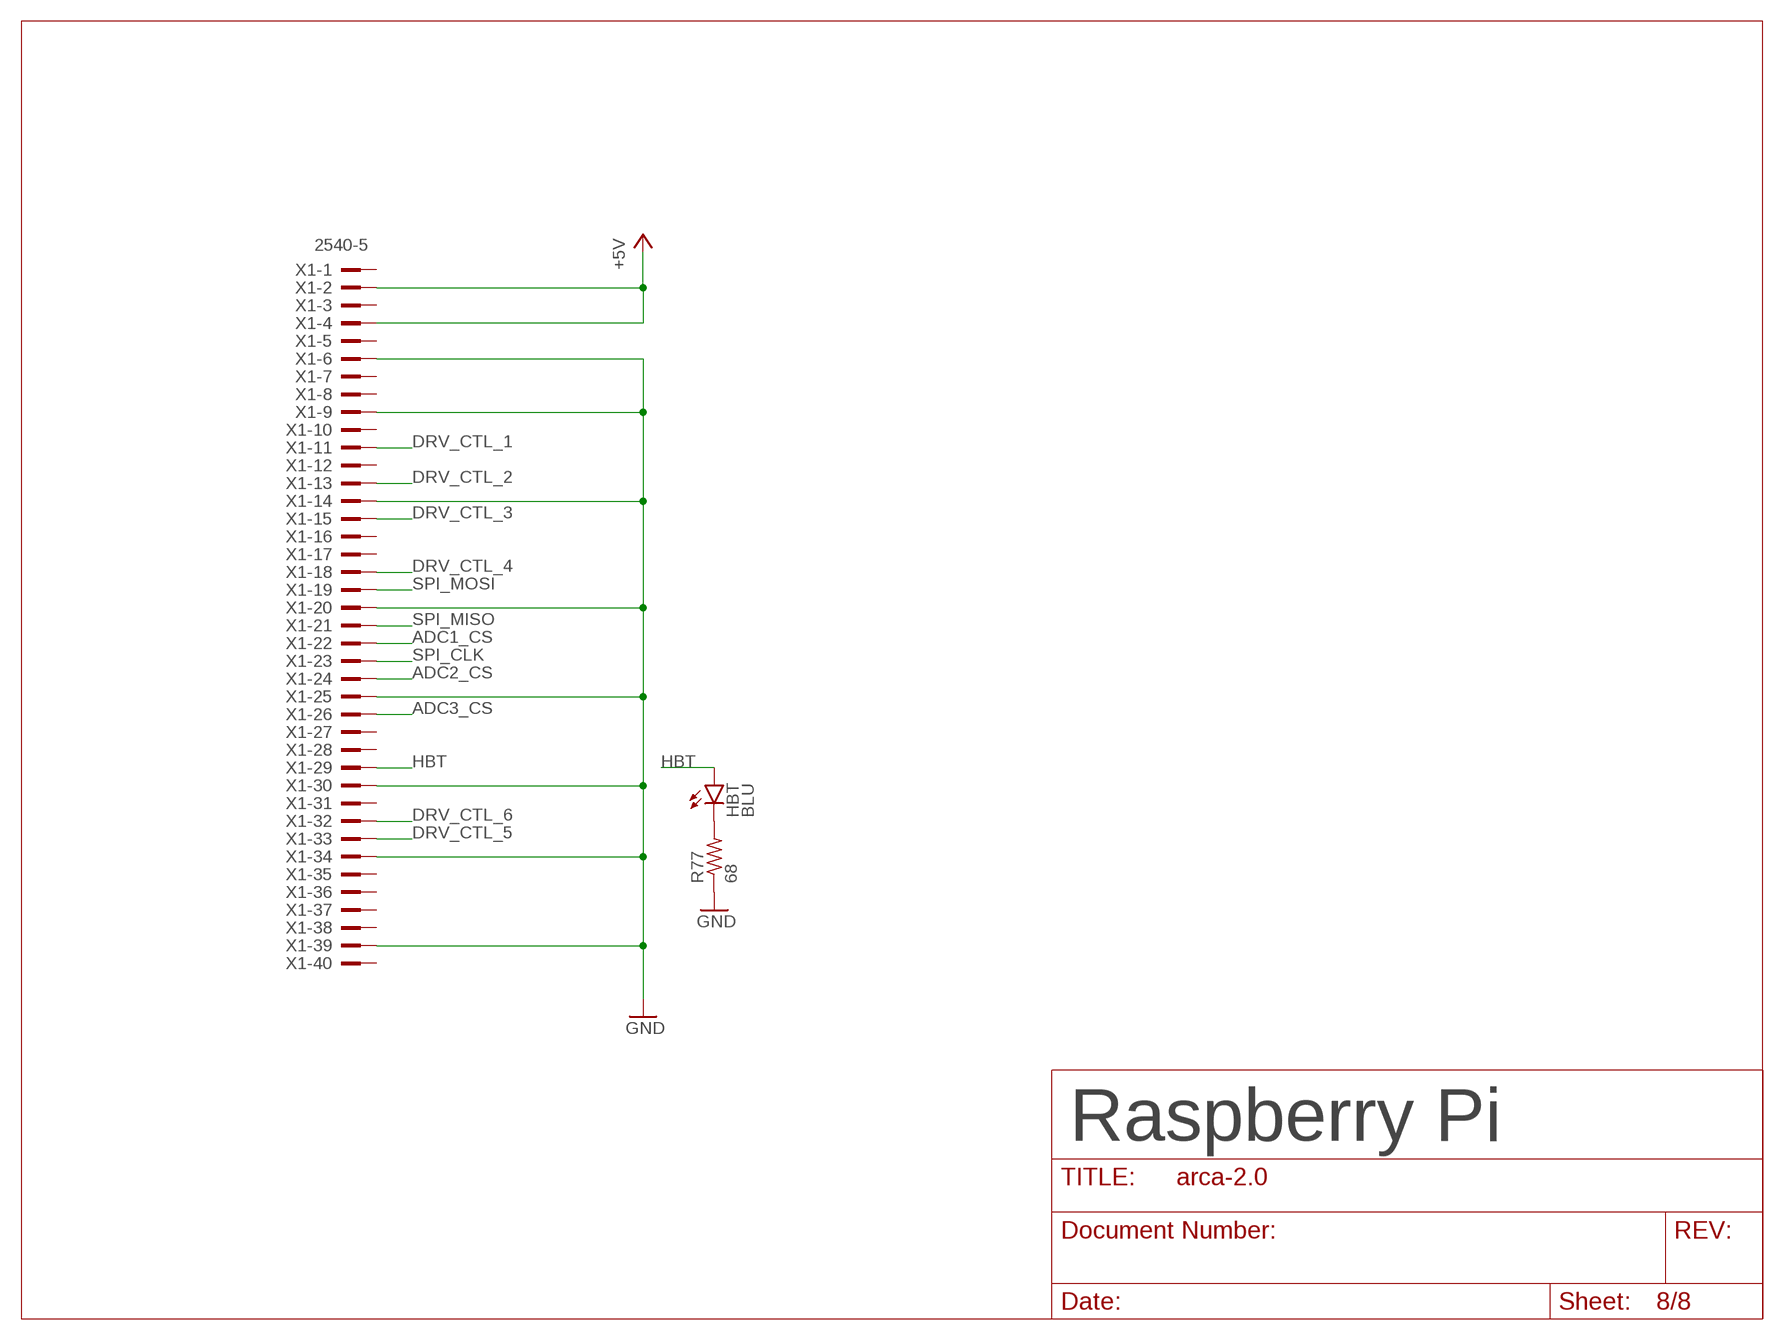
[diagram p7: schematic, sheet 8]

### Parts
HBT  BLU  LEDCHIPLED_1206  [CHIPLED_1206]
R77  68  R-US_R1206  [R1206]
X1  2540-5  [PAK100/2500-5-40]

### Nets
+5V [5V]: X1.2 X1.4 ; also sheet 1,2,3,6,7
ADC1_CS: X1.22 ; also sheet 7
ADC2_CS: X1.24 ; also sheet 7
ADC3_CS: X1.26 ; also sheet 7
DRV_CTL_1: X1.11 ; also sheet 2
DRV_CTL_2: X1.13 ; also sheet 2
DRV_CTL_3: X1.15 ; also sheet 2
DRV_CTL_4: X1.18 ; also sheet 2
DRV_CTL_5: X1.33 ; also sheet 2
DRV_CTL_6: X1.32 ; also sheet 2
GND: R77.1 X1.6 X1.9 X1.14 X1.20 X1.25 X1.30 X1.34 X1.39 ; also sheet 1,2,3,4,5,6,7
HBT: HBT.A X1.29
N$75: HBT.C R77.2
SPI_CLK: X1.23 ; also sheet 7
SPI_MISO: X1.21 ; also sheet 7
SPI_MOSI: X1.19 ; also sheet 7
Unconnected: X1.1 X1.3 X1.5 X1.7 X1.8 X1.10 X1.12 X1.16 X1.17 X1.27 X1.28 X1.31 X1.35 X1.36 X1.37 X1.38 X1.40

### Notes on the sheet
- Raspberry Pi

## Library data of the parts
ADC1-ADC3 = microchip-extra:MCP3208: 2.7V Dual Channel 12-Bit A/D Converter with SPI Serial Interface Source: http://ww1.microchip.com/downloads/en/DeviceDoc/21034D.pdf; MF: MICROCHIP; MPN: MCP3202-CI/SN; OC_FARNELL: 1196803; OC_NEWARK: 19C7207
C1-C29 = rcl:C-US: CAPACITOR, American symbol; SPICEPREFIX: C
CON_12V CON_BATTERY CON_DRV1-CON_DRV6 CON_FAN CON_PT1-CON_PT4 CON_ROUTER = con-phoenix-5mm:LPTA-2POS
CON_LC1-CON_LC4 = con-phoenix-5mm:LPTA-4POS
CON_TC1-CON_TC4 = con-phoenix-5mm:LPTA-3POS
D2 D3 D5-D10 = diode-ss:SS54
D4 = diode:DIODE-: DIODE
DRV_STAT_1-DRV_STAT_6 FS_STAT_1-FS_STAT_6 HBT PWR_5V PWR_10V PWR_12V = led:LED: LED OSRAM: - CHIPLED LG R971, LG N971, LY N971, LG Q971, LY Q971, LO R971, LY R971 LH N974, LH R974 LS Q976, LO Q976, LY Q976 LO Q996 - Hyper CHIPLED LW Q18S LB Q993, LB Q99A, LB R99A - SideLED LS A670, LO A670, LY A670, LG A670, LP A670 LB A673, LV A673, LT A673, LW A673 LH A674 LY A675 LS A676, LA A676, LO A676, LY A676, LW A676 LS A679, LY A679, LG A679 - Hyper Micro SIDELED® LS Y876, LA Y876, LO Y876, LY Y876 LT Y87S - SmartLED LW L88C, LW L88S LB L89C, LB L89S, LG L890 LS L89K, LO L89K, LY L89K LS L896, LA L896, LO L896, LY L896 - TOPLED LS T670, LO T670, LY T670, LG T670, LP T670 LSG T670, LSP T670, LSY T670, LOP T670, LYG T670 LG T671, LOG T671, LSG T671 LB T673, LV T673, LT T673, LW T673 LH T674 LS T676, LA T676, LO T676, LY T676, LB T676, LH T676, LSB T676, LW T676 LB T67C, LV T67C, LT T67C, LS T67K, LO T67K, LY T67K, LW E67C LS E67B, LA E67B, LO E67B, LY E67B, LB E67C, LV E67C, LT E67C LW T67C LS T679, LY T679, LG T679 LS T770, LO T770, LY T770, LG T770, LP T770 LB T773, LV T773, LT T773, LW T773 LH T774 LS E675, LA E675, LY E675, LS T675 LS T776, LA T776, LO T776, LY T776, LB T776 LHGB T686 LT T68C, LB T68C - Hyper Mini TOPLED® LB M676 - Mini TOPLED Santana® LG M470 LS M47K, LO M47K, LY M47K Source: http://www.osram.convergy.de LUXEON: - LUMILED® LXK2-PW12-R00, LXK2-PW12-S00, LXK2-PW14-U00, LXK2-PW14-V00 LXK2-PM12-R00, LXK2-PM12-S00, LXK2-PM14-U00 LXK2-PE12-Q00, LXK2-PE12-R00, LXK2-PE12-S00, LXK2-PE14-T00, LXK2-PE14-U00 LXK2-PB12-K00, LXK2-PB12-L00, LXK2-PB12-M00, LXK2-PB14-N00, LXK2-PB14-P00, LXK2-PB14-Q00 LXK2-PR12-L00, LXK2-PR12-M00, LXK2-PR14-Q00, LXK2-PR14-R00 LXK2-PD12-Q00, LXK2-PD12-R00, LXK2-PD12-S00 LXK2-PH12-R00, LXK2-PH12-S00 LXK2-PL12-P00, LXK2-PL12-Q00, LXK2-PL12-R00 Source: www.luxeon.com KINGBRIGHT: KA-3528ASYC Source: www.kingbright.com
FS1-FS18 = fuse-keystone:HOLDER_3588-20
IC1-IC4 = inamp-microchip:MCP6N11: Low Cost, Low Power, Instrumentation Amplifier Source: http://www.analog.com/UploadedFiles/Data_Sheets/37793330023930AD620_e.pdf; MPN: AD620AR; OC_FARNELL: 1464424; OC_NEWARK: 05F7109
IC5 = linear:LM324: OP AMP; SPICEPREFIX: J
IC6 = linear:LM324: OP AMP
JP1-JP3 JP5 JP7 = pinhead:PINHD-1X8: PIN HEADER
JP4 JP6 JP8 = pinhead:PINHD-1X4: PIN HEADER
R1-R45 R54-R77 RF1-RF4 RG1-RG4 = rcl:R-US_: RESISTOR, American symbol; SPICEPREFIX: R
R46-R48 R78 = pot:TRIM_US-: POTENTIOMETER
SW1 SW2 = switch-slide:1101M2S3CQE2; COPYRIGHT: Copyright (C) 2015 Accelerated Designs. All rights reserved; MANUFACTURER_PART_NUMBER: 1101M2S3CQE2; VENDOR: C&K
T1-T6 = transistor-FQP:FQP30N06L
VR2 = LM1084:LM1084
VR3 = LM1084:LM1084-ADJ
X1 = con-3m:2540-: 3M (TM) Pak 100 4-Wall Header Source: 3M; OC_FARNELL: 9838414; OC_NEWARK: unknown

## Net classes
1 12V: width 2.794 mm, drill 5.08 mm, clearance 0.508 mm
2 Driver: width 1.27 mm, drill 2.54 mm, clearance 0.254 mm
3 5V: width 0.254 mm, drill 0.508 mm, clearance 0.254 mm
5 10V: width 0.254 mm, drill 0.508 mm, clearance 0.254 mm